# EAGLE design TB01 (EAGLE 6.3)
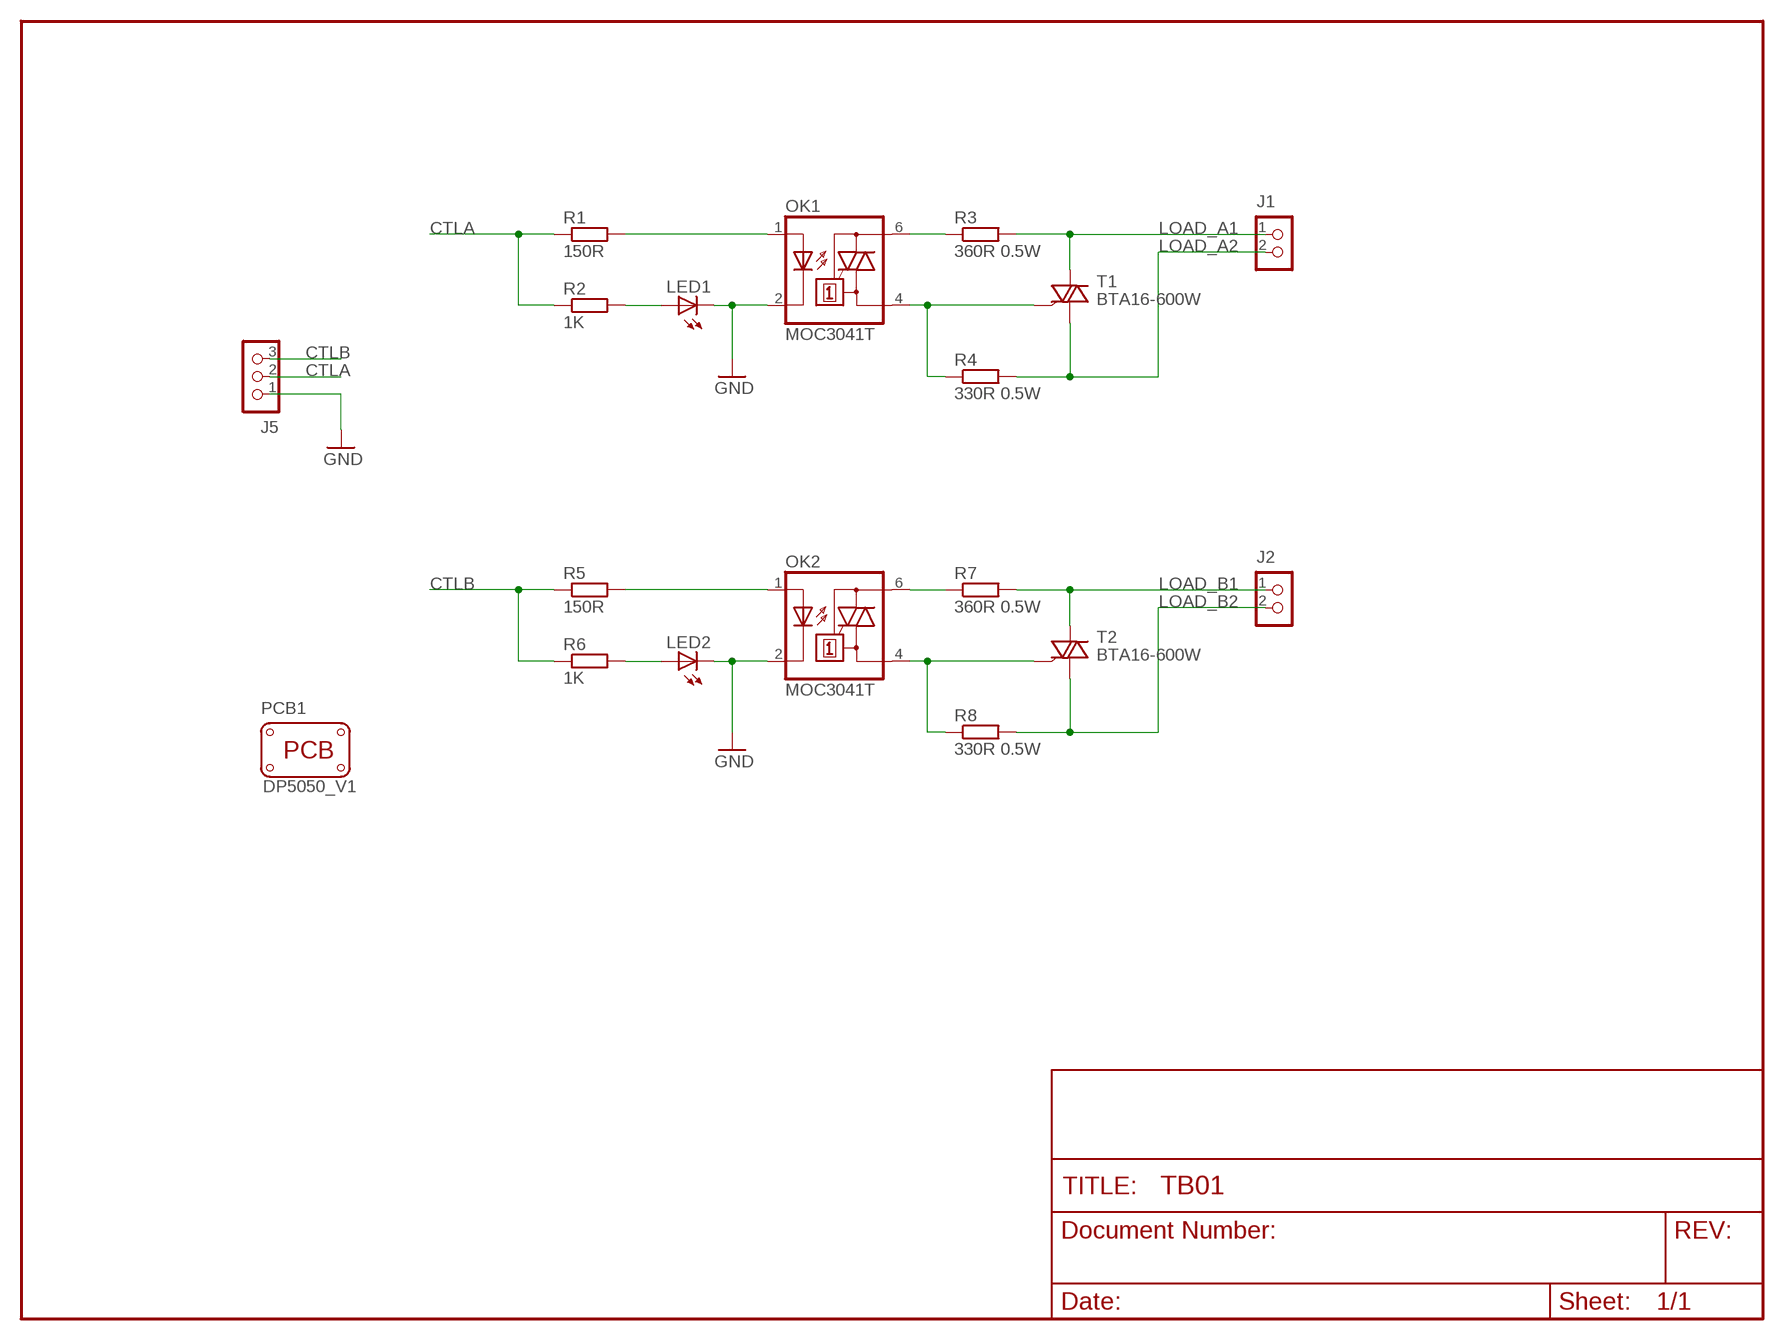
[diagram p0: schematic, sheet 1]

## Parts
J1  CON_TERMINAL_BLOCK_02-5MM  [TERMINAL_BLOCK_2P_5]
J2  CON_TERMINAL_BLOCK_02-5MM  [TERMINAL_BLOCK_2P_5]
J5  CON_TERMINAL_BLOCK_03-5MM  [TERMINAL_BLOCK_3P_5]
LED1  LED3MM  [LED3MM]
LED2  LED3MM  [LED3MM]
OK1  MOC3041T  [DIL06B]
OK2  MOC3041T  [DIL06B]
PCB1  PCB_DP_SQUARE-5X5  [DP5050_V1]
R1  150R  R-EU_0207/7  [0207/7]
R2  1K  R-EU_0207/7  [0207/7]
R3  360R 0.5W  R-EU_0411/3V  [0411V]
R4  330R 0.5W  R-EU_0411/3V  [0411V]
R5  150R  R-EU_0207/7  [0207/7]
R6  1K  R-EU_0207/7  [0207/7]
R7  360R 0.5W  R-EU_0411/3V  [0411V]
R8  330R 0.5W  R-EU_0411/3V  [0411V]
T1  BTA16-600W  BT138  [TO220DSH]
T2  BTA16-600W  BT138  [TO220DSH]

## Nets
CTLA: J5.2 R1.1 R2.1
CTLB: J5.3 R5.1 R6.1
GND: J5.1 LED1.K(C) LED2.K(C) OK1.2(C) OK2.2(C)
LOAD_A1: J1.1 R3.2 T1.A2
LOAD_A2: J1.2 R4.2 T1.A1
LOAD_B1: J2.1 R7.2 T2.A2
LOAD_B2: J2.2 R8.2 T2.A1
N$1: LED1.A R2.2
N$2: OK1.1(A) R1.2
N$3: OK1.6(A2) R3.1
N$4: OK2.6(A2) R7.1
N$5: OK1.4(A1) R4.1 T1.G
N$6: LED2.A R6.2
N$7: OK2.4(A1) R8.1 T2.G
N$8: OK2.1(A) R5.2

## Library data of the parts
J1 J2 = dp_devices:CON_TERMINAL_BLOCK_02: 2 poles wire to board terminal block
J5 = dp_devices:CON_TERMINAL_BLOCK_03: 3 poles, wire to board connector
LED1 LED2 = SparkFun:LED: LEDs Standard schematic elements and footprints for 5mm, 3mm, 1206, and 0603 sized LEDs. 5mm - Spark Fun Electronics SKU : COM-00529 (and others)
OK1 OK2 = optocoupler:MOC30*: 6-Pin DIP Zero-Cross Optoisolators Triac Driver Output (250/400 Volt Peak) Source: http://www.fairchildsemi.com/ds/MO/MOC3043-M.pdf; OC_FARNELL: unknown; OC_NEWARK: unknown
PCB1 = dp_devices:PCB_DP_SQUARE: Dangerous Prototypes Standard Square PCB sizes; PCB_SIZE: DP5050_V1
R1-R8 = rcl:R-EU_: RESISTOR, European symbol
T1 T2 = triac:BT138: TRIAC Source: http://www.semiconductors.philips.com BT138_SERIES_2.pdf

## Board
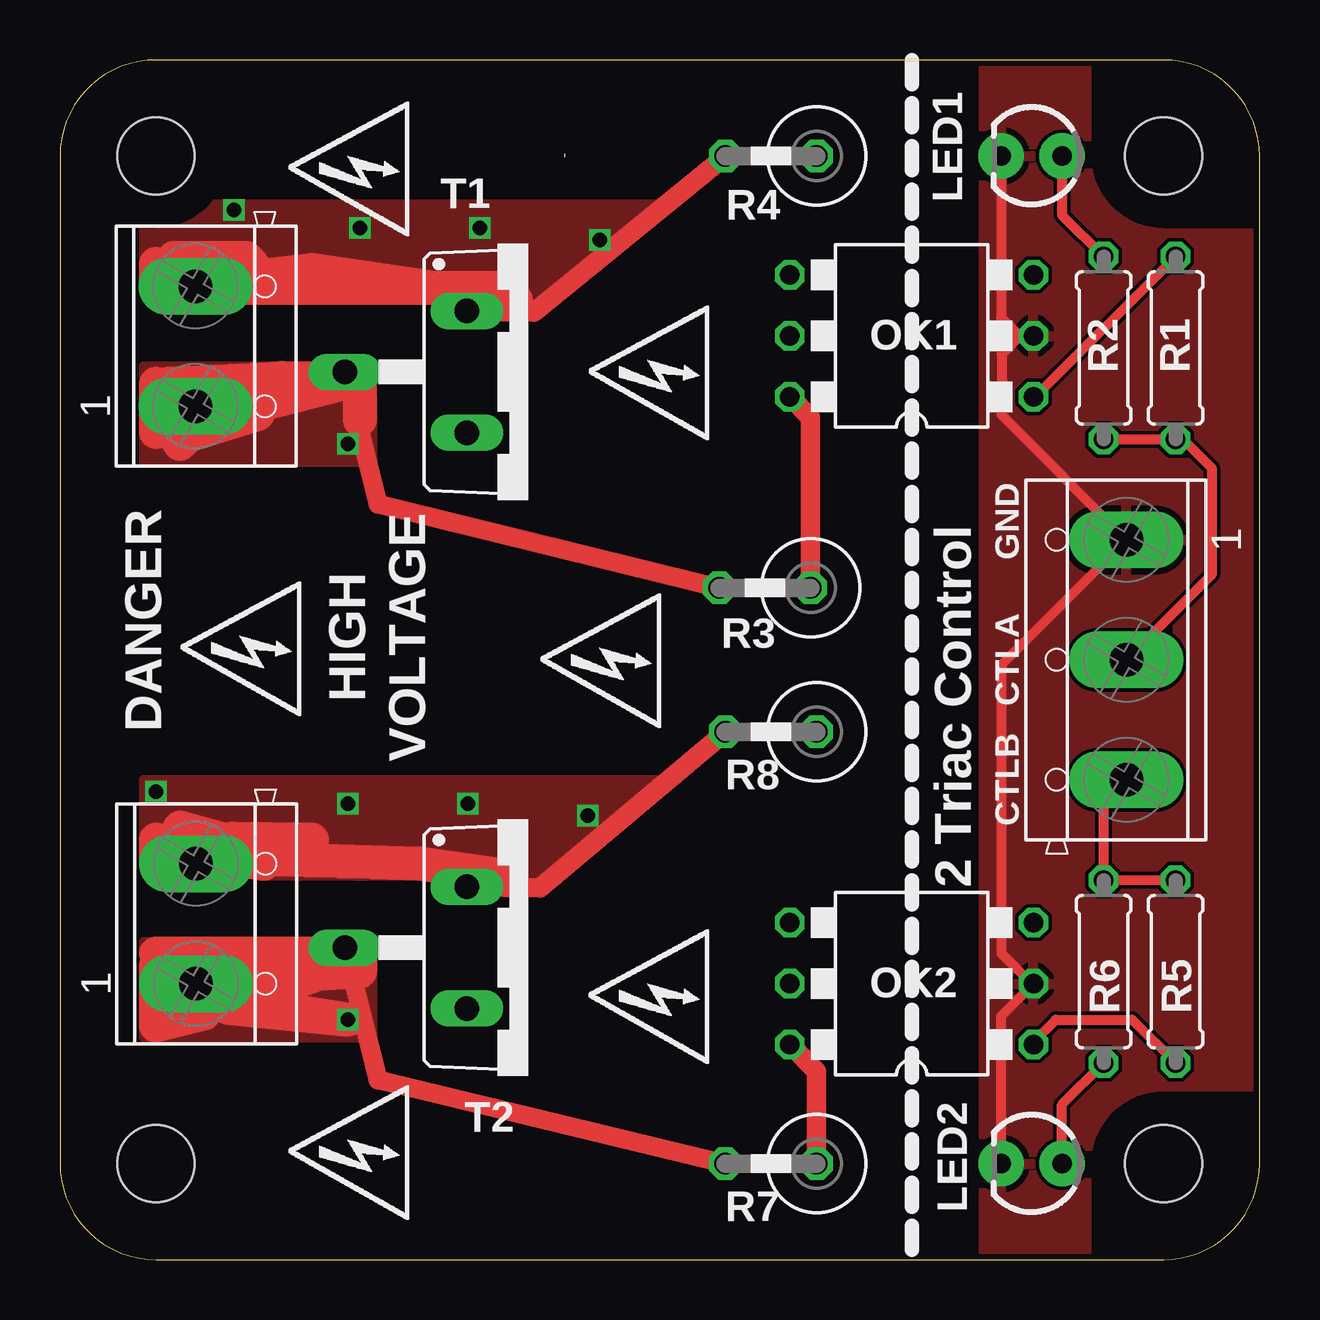
[diagram p1: board, top side]
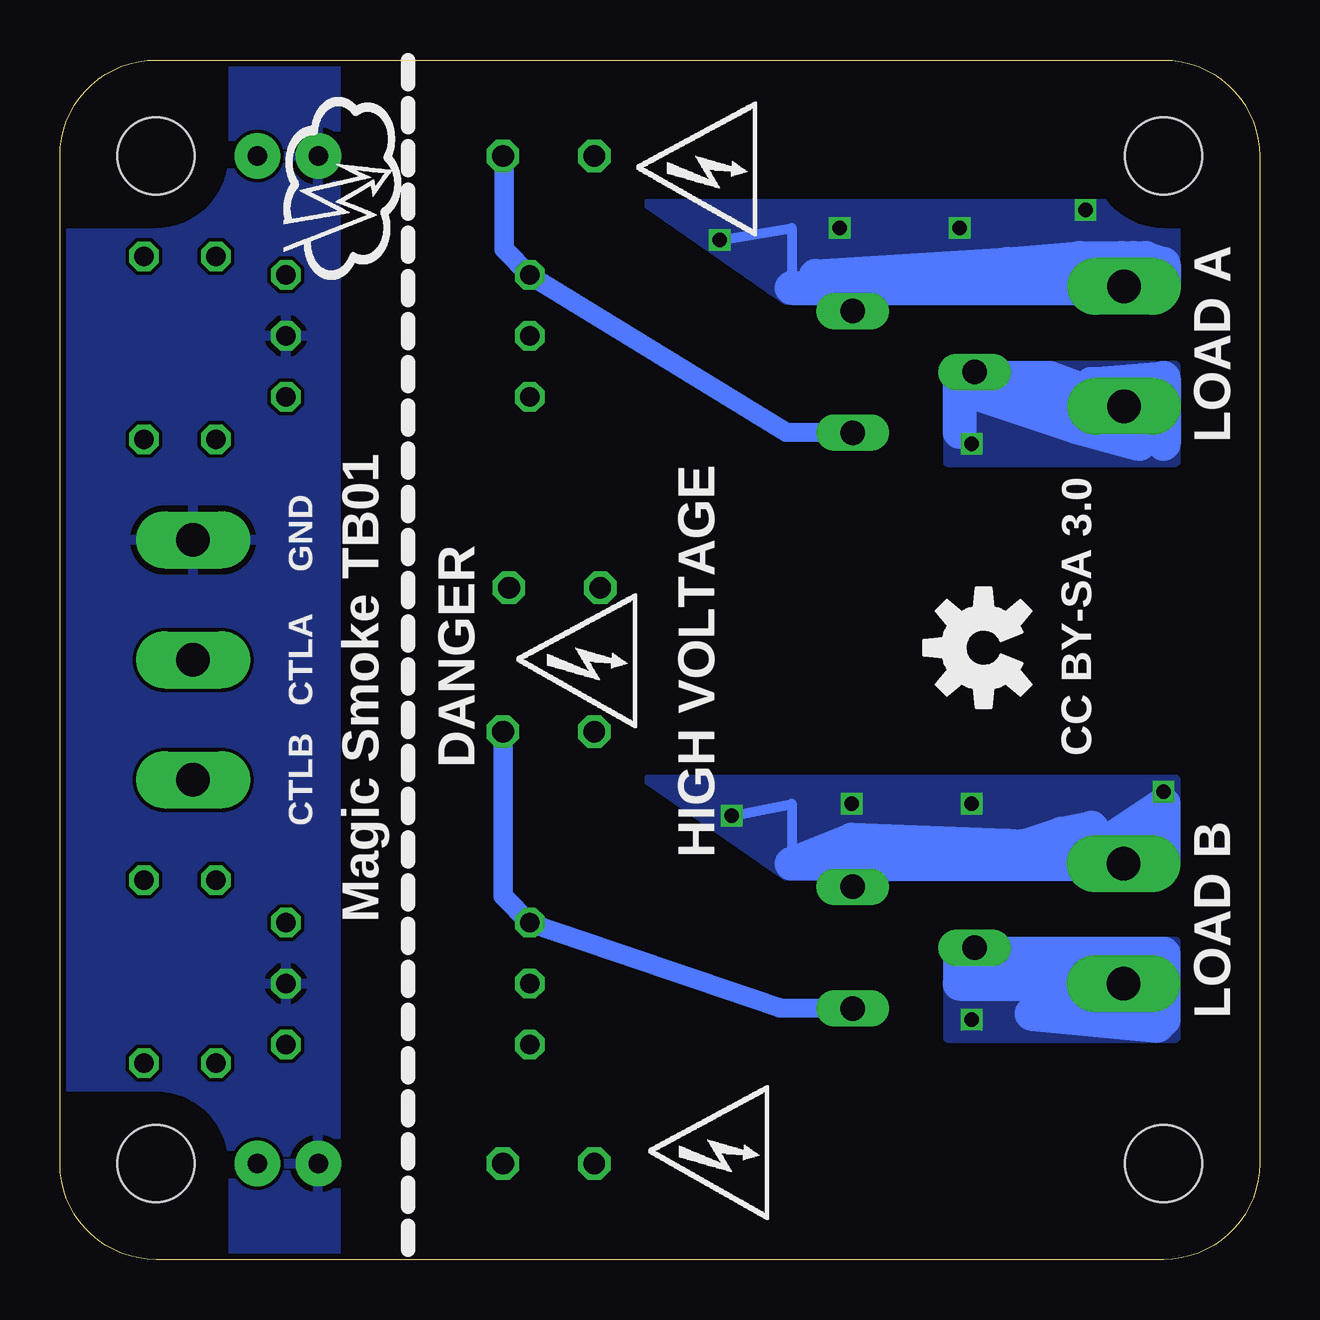
[diagram p2: board, bottom side, seen from below]

Size 50 x 50 mm. Coordinates in mm from the lower left corner, seen from the top.
Copper layers (1*2*15*16): Top 0.035mm / dielectric 0.2mm / Route2 0.0175mm / dielectric 1.1mm / Route15 0.0175mm / dielectric 0.2mm / Bottom 0.035mm
Design rules "SeeedStudio_DRU_no_angle_20130527": minimum track width 6mil, minimum drill 12mil, track to track 6mil, track to pad 6mil, pad to pad 6mil, via to via 6mil, smd to smd 0mil, copper to edge 10mil, drill to drill 10mil, minimum pad ring 6mil, minimum via ring 6mil, stop-mask expansion 2mil, vias tented up to drill 25mil, thermal gap 10mil

### Footprints (pad centres in the part's own frame; a part is rotated, then mirrored left to right if it is on the bottom)
TERMINAL_BLOCK_2P_5 = drill 1.4 pad 2.38 long: 1 2.5,-0.45; 2 -2.5,-0.45
TERMINAL_BLOCK_3P_5 = drill 1.4 pad 2.38 long: 1 5,-0.45; 2 0,-0.45; 3 -5,-0.45
LED3MM = drill 0.813 pad 1.88: A -1.27,0; K 1.27,0
DIL06B = drill 0.813 octagon: 1 -2.54,-5.08; 2 0,-5.08; 3 2.54,-5.08; 4 2.54,5.08; 5 0,5.08; 6 -2.54,5.08
DP5050_V1 = hole 3.2: 4,4; 46,4; 46,46; 4,46
0207/7 = drill 0.813 octagon: 1 -3.81,0; 2 3.81,0
0411V = drill 0.914 octagon: 1 -2.54,0; 2 1.27,0
TO220DSH = drill 1.016 long: A1 -2.54,-2.54; A2 0,-7.62; G 2.54,-2.54

### Placement (x,y rotation side)
J1  6.09,38.07 270 top
J2  6.12,14 270 top
J5  44,25 90 top
LED1  40.5,46 180 top
LED2  40.5,4 180 top
OK1  35.5,38.5 90 top
OK2  35.5,11.5 90 top
PCB1  0,0 0 top
R1  46.5,38 90 top
R2  43.5,38 90 top
R3  28.75,28 180 top
R4  29,46 180 top
R5  46.5,12 270 top
R6  43.5,12 270 top
R7  29,4 180 top
R8  29,22 180 top
T1  19.5,37 270 top
T2  19.5,13 270 top
U$2  [OSHW-LOGO-M]  11.5,25.5 90 bottom

### Tracks (layer width: path | path; a pad name or v marks a point on that pad's centre or on a via)
CTLA
  Top 0.406: R1.1 R2.1 46.81,34.19 48,33 48,28.55 J5.2
CTLB
  Top 0.406: R5.1 R6.1 43.5,19.05 J5.3
GND
  Top 0.406: LED1.K 39.23,39.27 40,38.5 | LED2.K 39.23,10.15 OK2.2 40.5,11.5 39.25,12.75 39.25,24.8 J5.1 39.25,35.2 39.25,37.75 40,38.5 | OK1.2 40,38.5
  pour Bottom: 38.5,52 51,52 51,-1 38.5,-1
  pour Top: 38.5,51 50,51 50,0 38.5,0
LOAD_A1  (via drill 0.6)
  Top 0.813: T1.A2 13.25,31.5 R3.2
  Top 1.422: 11.5,36.5 T1.A2 12.5,37 12.5,36.5 | 11.75,36.5 4,34.5 4,36.5 9.25,36.75 12,36.75 11.5,36.5 | 11.5,36.5 11.75,36.5 | 11.75,36.5 12.5,36.5 | 12.5,35 12.5,36.5 | 11.5,36.5 6.5,35.5 | 6.5,35.5 5,34 4,35.5 | 4,35.5 5,34.25 8.25,35.25 7.75,36.25 7.5,35.5 6.5,35.5 | 4,35.5 6.5,35.5 | 6.5,35.5 J1.1
  Bottom 1.422: 11.5,36.5 T1.A2 12.5,37 12.5,36.5 | 12.5,34.5 12.5,36.5 | 12.5,36.5 11.5,36.5 | 9.5,36.5 4,35.5 | 4,35.5 4,36.5 7,36.5 4,36.75 4,35 8.75,36.75 11.75,36.75 10.25,36.75 9.5,36.5 | 9.5,36.5 11.5,36.5 | 11.5,36.5 4,35.5 | 4,35.5 12.25,36.25 7.75,34.75 5,34 4,35.5 | 4,35.5 4,34 | 4,35.5 4.5,36 5.5,35.5 8,36 7.5,35.5 5.2,35.4
  other vias: 12,34
  pour Top: 3.5,37.25 13,37.25 13,33.25 3.5,33.25
  pour Bottom: 3.5,33.25 3.5,37.25 13,37.25 13,33.25
LOAD_A2  (via drill 0.6)
  Top 0.813: T1.A1 19.75,39.5 R4.2
  Top 1.422: T1.A1 19,40 10.5,41.25 4,40.5 | 18.5,40.5 4,40.5 | 4,40.5 4,41.5 7.25,41.75 | 7.25,41.75 8,41.5 7.75,41.75 7.25,41.75 | 7.25,41.75 4.75,41.75 5,41.5 5.67,40.54 J1.2
  Bottom 0.406: v22.5,42.5 19.5,43 19.5,40.5
  Bottom 1.422: 19.5,40.5 16,40.5 | 16,40.5 5.5,40.5 | 16,40.5 18.5,41 10.5,41.5 7.5,41.75 4.75,41.75 4,41.5 4,40.5 6,40.5 4.5,41.5 | 4.5,41.5 5,41.5 5.75,41.75 5.25,41.75 4.5,41.5 | 4.5,41.5 J1.2
  other vias: 7.25,43.75 17.5,43 12.5,43
  pour Bottom: 19.75,40 3.5,40.5 3.5,44 25.5,44
  pour Top: 3.5,40 3.5,44 25.5,44 20.25,40
LOAD_B1  (via drill 0.6)
  Top 0.813: T2.A2 13.25,7.5 R7.2
  Top 1.422: T2.A2 11,12 7,10.5 v12,10 5.5,11 9,11 10,12 8.75,12.75 12.25,12.75 4,12.75 6,10.25 4,9.75 4,11.5 | 4,11.5 4,12 | 4,12 4,12.25 | 4,12 10.5,12.5 12.5,13 12.5,12 4,11.5 | 4,11.5 5,11 8.5,12.5 J2.1
  Bottom 1.422: 12,13 11,12 7,10.5 10.5,12 8,11.5 12.5,11.5 12.5,13 10,12.5 12,12.75 4,12.75 4,10.25 4.5,12.5 4,10 8,12.5 4.25,9.75 9.5,10.25 4,11.5 5,11 9,10.5 J2.1
  pour Top: 3.5,13.25 13,13.25 13,9.25 3.5,9.25
  pour Bottom: 3.5,9.25 3.5,13.25 13,13.25 13,9.25
LOAD_B2  (via drill 0.6)
  Top 0.813: T2.A1 20,15.5 R8.2
  Top 1.422: T2.A1 18.5,16 15,16.5 6.75,16.75 | 6.75,16.75 6.5,16.5 6,16.5 6.75,16.75 | 9,17.5 6.75,16.75 | 6.75,16.75 7.75,17.25 5,18 4,16.5 4,17.5 8.5,16.5 6.25,16.75 6.5,16.75 5,16.5 10.5,17.5 7.21,17.54 J2.2
  Bottom 0.406: v22,18.5 19.5,19 19.5,16.5
  Bottom 1.422: 12.5,17 14,16.5 7,17 | 7,17 4,16.5 | 4,16.5 6,16.5 | 6,16.5 6,17 6.25,16.75 10.25,16.75 7,18 8.25,17.75 9.75,17.25 17,16.5 | 17,16.5 6,16.5 | 4,16.5 4,19 7,17 | 7,17 10.5,17.25 17,17.5 19.5,16.5 17,16.5 | T2.A1 17,16.5
  other vias: 4,19.5 12,19 17,19
  pour Bottom: 19.75,16 3.5,16.5 3.5,20 25.5,20
  pour Top: 3.5,16 3.5,20 25.5,20 20.25,16
N$1
  Top 0.406: LED1.A 41.77,43.54 R2.2
N$2
  Top 0.406: OK1.1 40.65,35.96 R1.2
N$3
  Top 0.813: R3.1 31.29,35.09 OK1.6
N$4
  Top 0.813: R7.1 31.54,7.84 OK2.6
N$5
  Bottom 0.813: T1.G 19.75,34.5 OK1.4 31.5,42.12 31.5,45.96 R4.1
N$6
  Top 0.406: LED2.A 41.77,6.46 R6.2
N$7
  Bottom 0.813: T2.G 20,10.5 OK2.4 31.54,15.16 R8.1
N$8
  Top 0.406: OK2.1 40.58,9.08 41.5,10 44.69,10 R5.2

### Text on the board
tPlace: GND | HIGH | CTLA | DANGER | VOLTAGE | CTLB | 2 Triac Control
bPlace: LOAD A | CC BY-SA 3.0 | GND | CTLA | DANGER | CTLB | HIGH VOLTAGE | Magic Smoke TB01 | LOAD B